# EAGLE design LPC_1TE_3.42b (EAGLE 5.04)
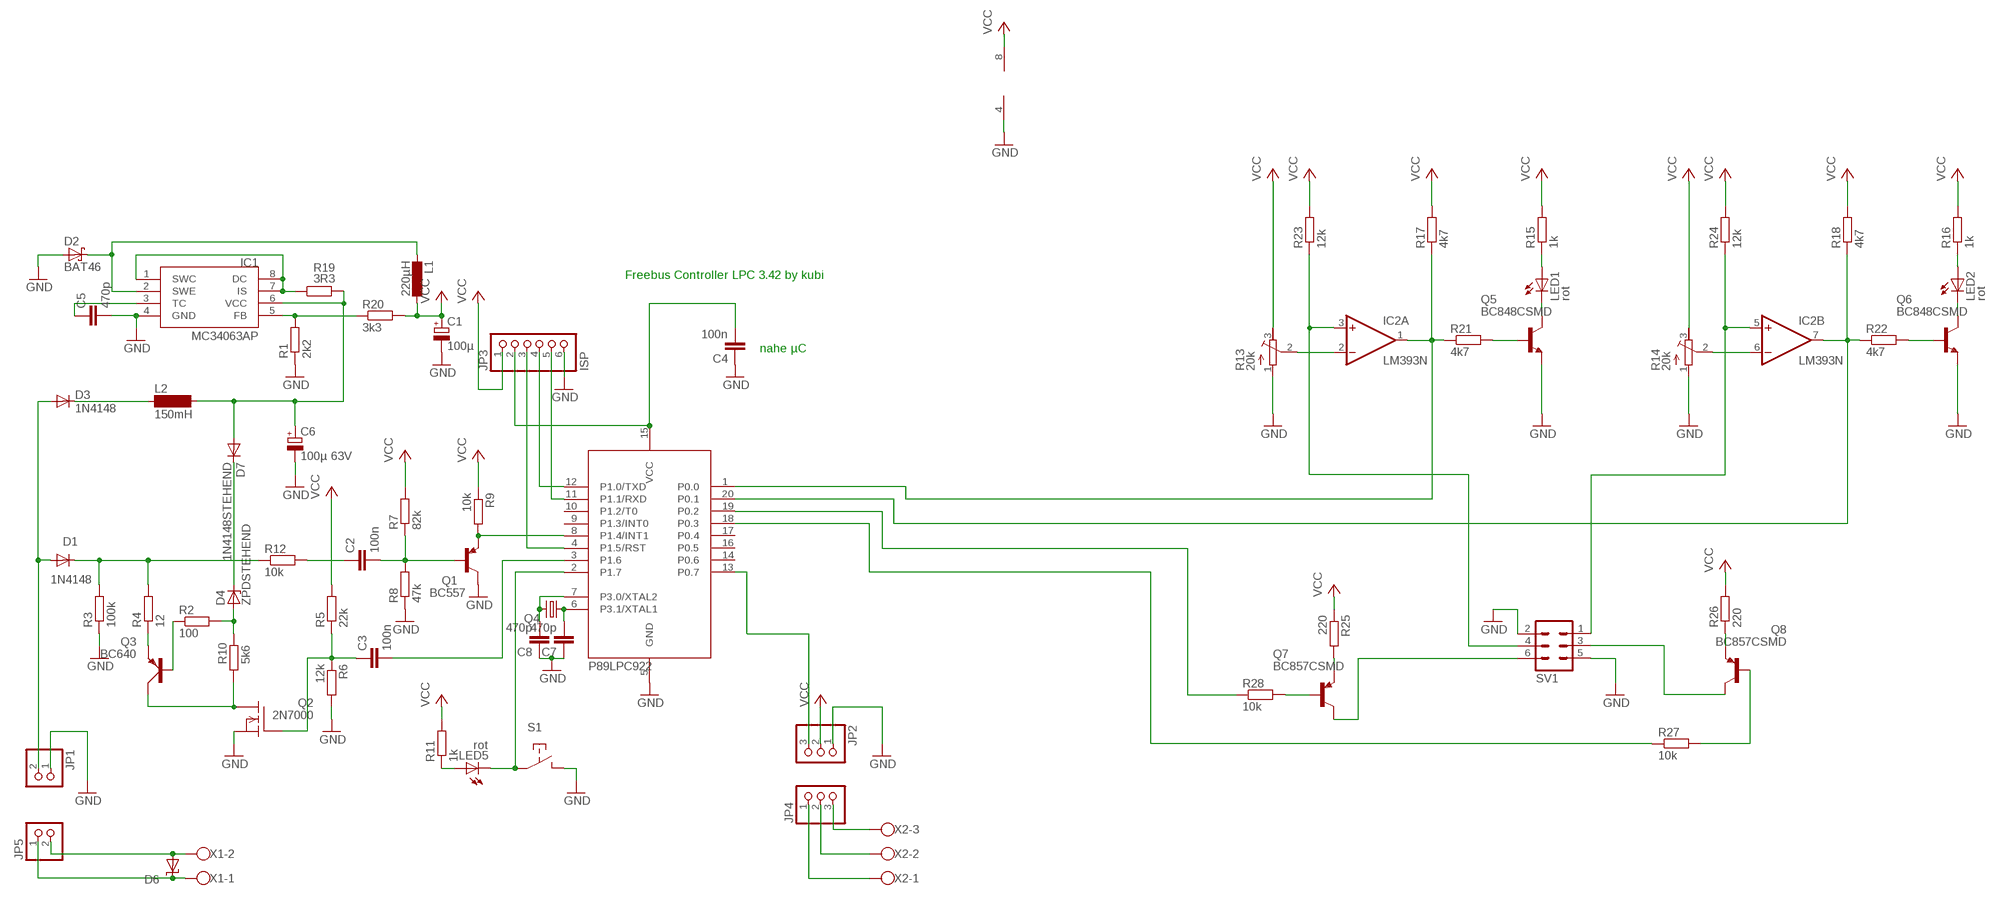
[diagram p0: schematic, sheet 1]

## Parts
C1  100µ  CPOL-EUE2.5-6  [E2,5-6]
C2  100n  C-EU025-024X044  [C025-024X044]
C3  100n  C-EU050-024X044  [C050-024X044]
C4  100n  C-EU050-024X044  [C050-024X044]
C5  470p  C-EU025-024X044  [C025-024X044]
C6  100µ 63V  CPOL-EUE3.5-8  [E3,5-8]
C7  470p  C-EU025-024X044  [C025-024X044]
C8  470p  C-EU025-024X044  [C025-024X044]
D1  1N4148  [DO35-10]
D2  BAT46  BAT49  [DO41-10]
D3  1N4148  [DO35-10]
D4  ZPDSTEHEND  [ZDIODE]
D6  SUPPRESSOR-SMBJ  [SMBJ]
D7  1N4148STEHEND  [D-2.5]
IC1  MC34063AP  [DIL08]
IC2  LM393N  [DIL08]
JP1  PINHD-1X2  [1X02]
JP2  PINHD-1X3  [1X03]
JP3  ISP  PINHD-1X6  [1X06]
JP4  PINHD-1X3  [1X03]
JP5  PINHD-1X2  [1X02]
L1  220µH  L-EU2200-12.7  [2200-12.7]
L2  150mH  SD12K100  [SD12K100]
LED1  rot  LED3MM  [LED3MM]
LED2  rot  LED3MM  [LED3MM]
LED5  rot  LED3MM  [LED3MM]
Q1  BC557  [TO92]
Q2  2N7000  VN2222KM  [TO237]
Q3  BC640  [SOT54D]
Q4  CRYSTALHC49U-V  [HC49U-V]
Q5  BC848CSMD  [SOT23]
Q6  BC848CSMD  [SOT23]
Q7  BC857CSMD  [SOT23-BEC]
Q8  BC857CSMD  [SOT23-BEC]
R1  2k2  R-EU_0207/7  [0207/7]
R2  100  R-EU_0207/2V  [0207/2V]
R3  100k  R-EU_0207/2V  [0207/2V]
R4  12  R-EU_0207/2V  [0207/2V]
R5  22k  R-EU_0207/2V  [0207/2V]
R6  12k  R-EU_0207/2V  [0207/2V]
R7  82k  R-EU_0207/7  [0207/7]
R8  47k  R-EU_0207/7  [0207/7]
R9  10k  R-EU_0207/7  [0207/7]
R10  5k6  R-EU_0207/2V  [0207/2V]
R11  1k  R-EU_0207/7  [0207/7]
R12  10k  R-EU_0207/7  [0207/7]
R13  20k  R-TRIMM64X  [RTRIM64X]
R14  20k  R-TRIMM64X  [RTRIM64X]
R15  1k  R-EU_M1206  [M1206]
R16  1k  R-EU_M1206  [M1206]
R17  4k7  R-EU_M1206  [M1206]
R18  4k7  R-EU_M1206  [M1206]
R19  3R3  R-EU_0207/2V  [0207/2V]
R20  3k3  R-EU_0207/2V  [0207/2V]
R21  4k7  R-EU_M1206  [M1206]
R22  4k7  R-EU_M1206  [M1206]
R23  12k  R-EU_M1206  [M1206]
R24  12k  R-EU_M1206  [M1206]
R25  220  R-EU_M1206  [M1206]
R26  220  R-EU_M1206  [M1206]
R27  10k  R-EU_0207/7  [0207/7]
R28  10k  R-EU_0207/7  [0207/7]
S1  3305  [3305]
SV1  MA03-2LIEGEND  [MA03-2W]
U1  89LPC922  [DIL20]
X1  W237-02P  [W237-132]
X2  W237-03P  [W237-133]

## Nets
GND: C1.- C4.1 C5.2 C6.- C7.1 C8.1 D2.A IC1.4(GND) IC2.4(P:V-) JP1.1 JP2.1 JP3.6 Q1.3(C) Q2.3(S) Q5.2(E) Q6.2(E) R1.1 R3.1 R6.2 R8.1 R13.1(E) R14.1(E) S1.P$2 SV1.2 SV1.5 U1.5(GND)
N$1: Q1.1(E) R9.2 U1.8(P1.4/INT1)
N$2: C2.2 Q1.2(B) R7.1 R8.2
N$3: IC1.5(FB) R1.2 R20.1
N$4: IC1.1(SWC) IC1.7(IS) IC1.8(DC) R19.1
N$5: C3.2 U1.3(P1.6)
N$6: Q2.1(D) Q3.C R10.1
N$7: C6.+ D7.A IC1.6(VCC) L2.2 R19.2
N$8: D3.C L2.1
N$9: D1.C R3.2 R4.2 R12.1
N$10: D2.C IC1.2(SWE) L1.2
N$11: D4.A R2.2 R10.2
N$12: Q3.E R4.1
N$13: C5.1 IC1.3(TC)
N$14: Q3.B R2.1
N$15: LED5.K(C) S1.P$1 U1.2(P1.7)
N$16: D1.A D3.A JP1.2
N$17: D6.A JP5.2 X1.2
N$18: D6.C JP5.1 X1.1
N$19: JP4.3 X2.3
N$20: IC2.6(B:-IN) R14.2(S)
N$21: IC2.2(A:-IN) R13.2(S)
N$22: LED1.K(C) Q5.3(C)
N$23: LED1.A R15.1
N$24: C7.2 Q4.1 U1.6(P3.1/XTAL1)
N$25: C8.2 Q4.2 U1.7(P3.0/XTAL2)
N$26: JP4.2 X2.2
N$27: JP4.1 X2.1
N$28: JP2.3 U1.13(P0.7)
N$29: JP3.4 U1.12(P1.0/TXD)
N$30: JP3.5 U1.11(P1.1/RXD)
N$31: JP3.3 U1.4(P1.5/RST)
N$32: C4.2 JP3.2 U1.15(VCC)
N$33: C2.1 R12.2
N$34: C3.1 Q2.2(G) R5.1 R6.1
N$35: IC2.1(A:OUT) R17.1 R21.1 U1.1(P0.0)
N$36: LED2.K(C) Q6.3(C)
N$37: IC2.7(B:OUT) R18.1 R22.1 U1.20(P0.1)
N$38: Q5.1(B) R21.2
N$39: Q6.1(B) R22.2
N$40: D4.C D7.C
N$41: LED5.A R11.1
N$42: LED2.A R16.1
N$43: IC2.3(A:+IN) R23.1 SV1.4
N$44: IC2.5(B:+IN) R24.1 SV1.1
N$45: Q7.B R28.2
N$46: Q8.E R26.1
N$47: Q7.C SV1.6
N$48: Q7.E R25.2
N$49: Q8.C SV1.3
N$51: R28.1 U1.19(P0.2)
N$52: R27.1 U1.18(P0.3)
N$53: Q8.B R27.2
VCC: C1.+ IC2.8(P:V+) JP2.2 JP3.1 L1.1 R5.2 R7.2 R9.1 R11.2 R13.3(A) R14.3(A) R15.2 R16.2 R17.2 R18.2 R20.2 R23.2 R24.2 R25.1 R26.2
Unconnected: U1.9(P1.3/INT0) U1.10(P1.2/T0) U1.14(P0.6) U1.16(P0.5) U1.17(P0.4)

## Notes on the sheet
- Freebus Controller LPC 3.42 by kubi
- nahe µC
- P89LPC922

## Library data of the parts
C1 C6 = rcl:CPOL-EU: POLARIZED CAPACITOR, European symbol
C2-C5 C7 C8 = rcl:C-EU: CAPACITOR, European symbol
D1 D3 D7 = diode:1N4148: DIODE high speed (Philips)
D2 = diode:BAT49: DIODE small signal diode
D4 = diode:ZPD: Z DIODE 500 mW
D6 = diode:SUPPRESSOR-: Suppressor diode
IC1 = mc34063:MC34063
IC2 = linear:LM393: COMPARATOR
JP1 JP5 = pinhead:PINHD-1X2: PIN HEADER
JP2 JP4 = pinhead:PINHD-1X3: PIN HEADER
JP3 = pinhead:PINHD-1X6: PIN HEADER
L1 = rcl:L-EU: INDUCTOR, European symbol
L2 = inductor-neosid:SD12: INDUCTOR nominal inductance
LED1 LED2 LED5 = led:LED: LED OSRAM: - CHIPLED LG R971, LG N971, LY N971, LG Q971, LY Q971, LO R971, LY R971 LH N974, LH R974 LS Q976, LO Q976, LY Q976 LO Q996 - Hyper CHIPLED LW Q18S LB Q993, LB Q99A, LB R99A - SideLED LS A670, LO A670, LY A670, LG A670, LP A670 LB A673, LV A673, LT A673, LW A673 LH A674 LY A675 LS A676, LA A676, LO A676, LY A676, LW A676 LS A679, LY A679, LG A679 - Hyper Micro SIDELED® LS Y876, LA Y876, LO Y876, LY Y876 LT Y87S - SmartLED LW L88C, LW L88S LB L89C, LB L89S, LG L890 LS L89K, LO L89K, LY L89K LS L896, LA L896, LO L896, LY L896 - TOPLED LS T670, LO T670, LY T670, LG T670, LP T670 LSG T670, LSP T670, LSY T670, LOP T670, LYG T670 LG T671, LOG T671, LSG T671 LB T673, LV T673, LT T673, LW T673 LH T674 LS T676, LA T676, LO T676, LY T676, LB T676, LH T676, LSB T676, LW T676 LB T67C, LV T67C, LT T67C, LS T67K, LO T67K, LY T67K, LW E67C LS E67B, LA E67B, LO E67B, LY E67B, LB E67C, LV E67C, LT E67C LW T67C LS T679, LY T679, LG T679 LS T770, LO T770, LY T770, LG T770, LP T770 LB T773, LV T773, LT T773, LW T773 LH T774 LS E675, LA E675, LY E675, LS T675 LS T776, LA T776, LO T776, LY T776, LB T776 LHGB T686 LT T68C, LB T68C - Hyper Mini TOPLED® LB M676 - Mini TOPLED Santana® LG M470 LS M47K, LO M47K, LY M47K Source: http://www.osram.convergy.de - LUMILED® LXK2-PW12-R00, LXK2-PW12-S00, LXK2-PW14-U00, LXK2-PW14-V00 LXK2-PM12-R00, LXK2-PM12-S00, LXK2-PM14-U00 LXK2-PE12-Q00, LXK2-PE12-R00, LXK2-PE12-S00, LXK2-PE14-T00, LXK2-PE14-U00 LXK2-PB12-K00, LXK2-PB12-L00, LXK2-PB12-M00, LXK2-PB14-N00, LXK2-PB14-P00, LXK2-PB14-Q00 LXK2-PR12-L00, LXK2-PR12-M00, LXK2-PR14-Q00, LXK2-PR14-R00 LXK2-PD12-Q00, LXK2-PD12-R00, LXK2-PD12-S00 LXK2-PH12-R00, LXK2-PH12-S00 LXK2-PL12-P00, LXK2-PL12-Q00, LXK2-PL12-R00 Source: www.luxeon.com
Q1 = transistor-pnp:BC557: PNP Transistor
Q2 = transistor-fet:VN2222KM: N-Channel Enhancement MOSFET (VMOS); 60V; 0,5A; 7,5Ohm
Q3 = transistor-small-signal:BC640: PNP TRANSISTOR
Q4 = crystal:CRYSTAL: CRYSTAL
Q5 Q6 = transistor-npn:BC848*: NPN Transistor
Q7 Q8 = transistor-pnp:BC857*: PNP Transistror
R1-R12 R15-R28 = rcl:R-EU_: RESISTOR, European symbol
R13 R14 = rcl:R-TRIMM: Trimm resistor
S1 = kubi:3305: Taster 3305
SV1 = con-lstb:MA03-2: PIN HEADER
U1 = micro-philips:89LPC922
X1 = con-wago-508:W237-02P: WAGO SREW CLAMP
X2 = con-wago-508:W237-03P: WAGO SREW CLAMP

## Board
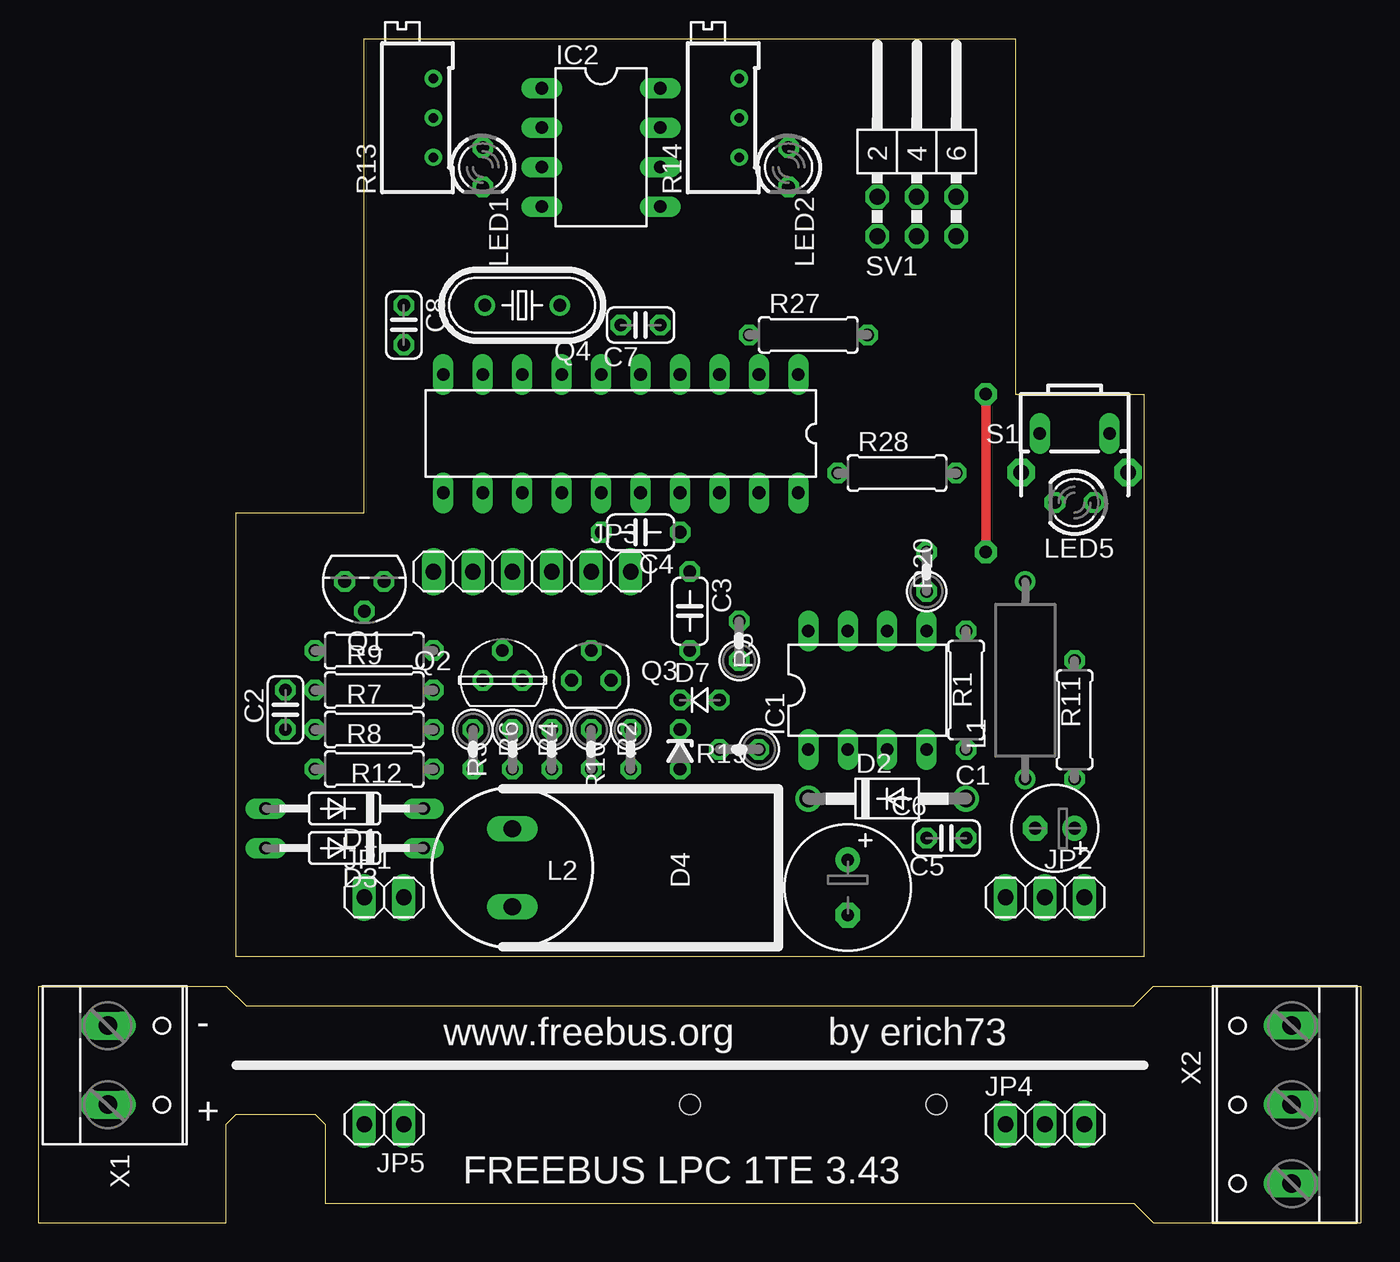
[diagram p1: board, top side]
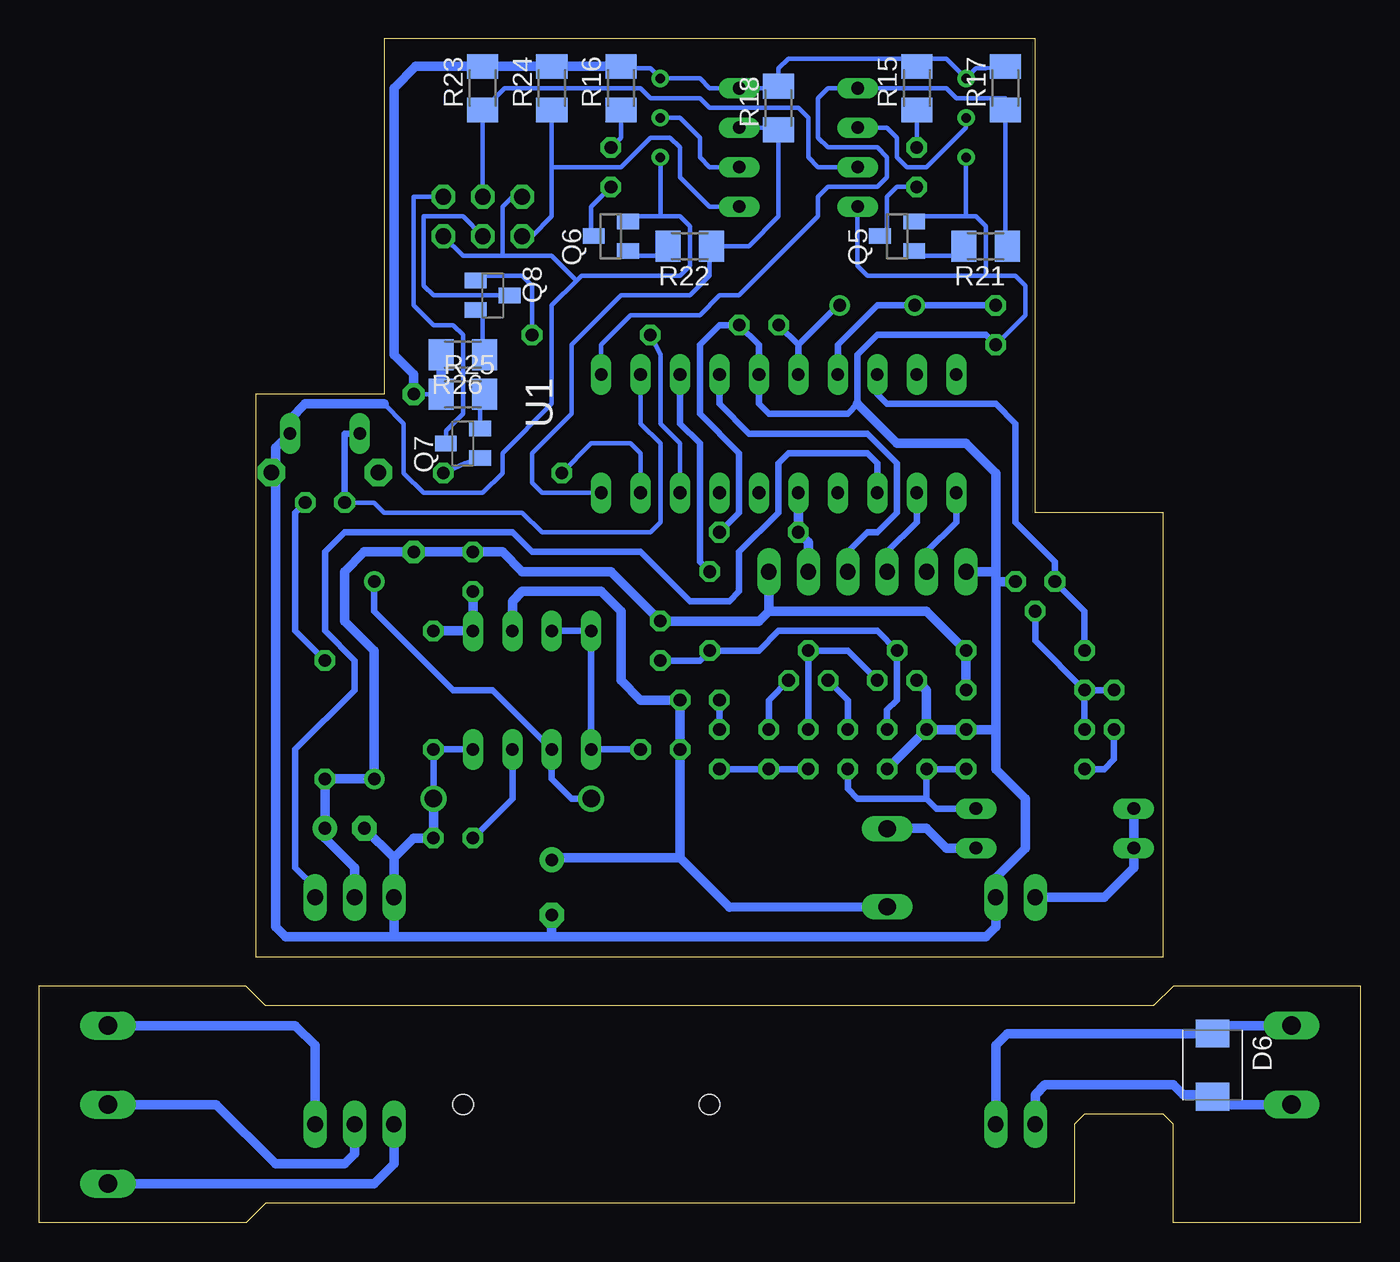
[diagram p2: board, bottom side, seen from below]

Size 85.09 x 76.2 mm. Coordinates in mm from the lower left corner, seen from the top.
Outline: 12.7,17.14 12.7,45.72 20.95,45.72 20.95,76.2 62.87,76.2 62.87,53.34 71.12,53.34 71.12,17.14 12.7,17.14
Outline: 0,0 12.06,0 12.06,6.35 12.7,6.98 17.78,6.98 18.41,6.35 18.41,1.27 70.48,1.27 71.75,0 85.09,0 85.09,15.24 71.75,15.24 70.48,13.97 13.34,13.97 12.06,15.24 0,15.24 0,0
Copper layers (1*16): Top 0.035mm / dielectric 1.5mm / Bottom 0.035mm
Design rules "default *": minimum track width 10mil, minimum drill 24mil, track to track 12mil, track to pad 10mil, pad to pad 12mil, via to via 12mil, smd to smd 8mil, copper to edge 10mil, drill to drill 8mil, minimum pad ring 10mil, minimum via ring 8mil, stop-mask expansion 4mil, vias tented up to drill 0mil, thermal gap 10mil
Holes 1.3 mm at 57.79,7.62 41.91,7.62

### Footprints (pad centres in the part's own frame; a part is rotated, then mirrored left to right if it is on the bottom)
E2,5-6 = drill 0.813 pad 1.6 round: + -1.27,0 | drill 0.813 pad 1.6 octagon: - 1.27,0
C025-024X044 = drill 0.813 octagon: 1 -1.27,0; 2 1.27,0
C050-024X044 = drill 0.813 octagon: 1 -2.54,0; 2 2.54,0
E3,5-8 = drill 0.813 pad 1.6 round: + -1.778,0 | drill 0.813 pad 1.6 octagon: - 1.778,0
DO35-10 = drill 0.813 long: A 5.08,0; C -5.08,0
DO41-10 = drill 1.118 round: A 5.08,0; C -5.08,0
ZDIODE = drill 0.813 octagon: A 1.27,0; C -1.27,0
SMBJ = smd 1.78 x 2.16: A 2.04,0; C -2.03,0
D-2.5 = drill 0.813 octagon: A 1.27,0; C -1.27,0
DIL08 = drill 0.813 long: 1 -3.81,-3.81; 2 -1.27,-3.81; 3 1.27,-3.81; 4 3.81,-3.81; 5 3.81,3.81; 6 1.27,3.81; 7 -1.27,3.81; 8 -3.81,3.81
1X02 = drill 1.016 long: 1 -1.27,0; 2 1.27,0
1X03 = drill 1.016 long: 1 -2.54,0; 2 0,0; 3 2.54,0
1X06 = drill 1.016 long: 1 -6.35,0; 2 -3.81,0; 3 -1.27,0; 4 1.27,0; 5 3.81,0; 6 6.35,0
2200-12.7 = drill 0.8 pad 1.27 round: 1 -6.35,0; 2 6.35,0
SD12K100 = drill 1.1 long: 1 -2.5,0; 2 2.5,0
LED3MM = drill 0.813 octagon: A -1.27,0; K 1.27,0
TO92 = drill 0.813 octagon: 1 1.27,0; 2 0,1.905; 3 -1.27,0
TO237 = drill 0.813 octagon: 1 1.27,0; 2 0,1.905; 3 -1.27,0
SOT54D = drill 0.813 octagon: B 1.27,0; C 0,1.905; E -1.27,0
HC49U-V = drill 0.813 round: 1 -2.413,0; 2 2.413,0
SOT23 = smd 1 x 1.4: 1 -0.95,-1.1; 2 0.95,-1.1; 3 0,1.1
SOT23-BEC = smd 1 x 1.4: B -0.95,-1.1; C 0,1.1; E 0.95,-1.1
0207/7 = drill 0.813 octagon: 1 -3.81,0; 2 3.81,0
0207/2V = drill 0.813 octagon: 1 -1.27,0; 2 1.27,0
RTRIM64X = drill 0.61 round: 1 1.27,-2.54; 2 1.27,0; 3 1.27,2.54
M1206 = smd 1.6 x 2: 1 -1.4,0; 2 1.4,0
3305 = drill 0.8 long: P$1 -2.25,0; P$2 2.25,0 | drill 1 pad 1.778 octagon: P$3 -3.45,-2.5; P$4 3.45,-2.5
MA03-2W = drill 1.016 octagon: 1 -2.54,-5.08; 2 -2.54,-2.54; 3 0,-5.08; 4 0,-2.54; 5 2.54,-5.08; 6 2.54,-2.54
DIL20 = drill 0.813 long: 1 -11.43,-3.81; 2 -8.89,-3.81; 3 -6.35,-3.81; 4 -3.81,-3.81; 5 -1.27,-3.81; 6 1.27,-3.81; 7 3.81,-3.81; 8 6.35,-3.81; 9 8.89,-3.81; 10 11.43,-3.81; 11 11.43,3.81; 12 8.89,3.81; 13 6.35,3.81; 14 3.81,3.81; 15 1.27,3.81; 16 -1.27,3.81; 17 -3.81,3.81; 18 -6.35,3.81; 19 -8.89,3.81; 20 -11.43,3.81
W237-132 = drill 1.194 long: 1 -2.54,-0.635; 2 2.54,-0.635
W237-133 = drill 1.194 long: 1 -5.08,-0.635; 2 0,-0.635; 3 5.08,-0.635

### Placement (x,y rotation side)
C1  65.41,25.4 180 top
C2  15.88,33.02 90 top
C3  41.91,39.37 90 top
C4  38.73,44.45 180 top
C5  58.42,24.77 0 top
C6  52.07,21.59 270 top
C7  38.73,57.79 180 top
C8  23.49,57.79 90 top
D1  19.68,26.67 180 top
D2  54.61,27.3 0 top
D3  19.68,24.13 180 top
D4  41.27,30.48 270 top
D6  9.53,10.16 270 bottom
D7  42.55,33.66 0 top
IC1  53.34,34.29 0 top
IC2  36.2,69.21 270 top
JP1  22.22,20.95 180 top
JP2  64.77,20.95 0 top
JP3  31.75,41.91 180 top
JP4  64.77,6.35 0 top
JP5  22.22,6.35 180 top
L1  63.5,34.93 90 top
L2  30.48,22.86 270 top
LED1  28.57,67.94 270 top
LED2  48.26,67.94 270 top
LED5  66.67,46.36 180 top
Q1  20.95,41.28 180 top
Q2  29.84,34.93 0 top
Q3  35.56,34.93 0 top
Q4  31.11,59.05 180 top
Q5  29.84,63.5 90 bottom
Q6  48.26,63.5 90 bottom
Q7  57.79,50.17 90 bottom
Q8  55.88,59.69 270 bottom
R1  59.69,34.29 90 top
R2  38.1,30.48 270 top
R3  27.94,30.48 270 top
R4  33.02,30.48 270 top
R5  45.09,37.47 90 top
R6  30.48,30.48 270 top
R7  21.59,34.29 0 top
R8  21.59,31.75 180 top
R9  21.59,36.83 180 top
R10  35.56,30.48 270 top
R11  66.67,32.38 270 top
R12  21.59,29.21 180 top
R13  24.13,71.12 0 top
R14  43.82,71.12 0 top
R15  28.57,73.02 90 bottom
R16  47.62,73.02 90 bottom
R17  22.86,73.02 90 bottom
R18  37.47,71.75 90 bottom
R19  45.09,30.48 180 top
R20  57.15,41.91 90 top
R21  24.13,62.87 180 bottom
R22  43.18,62.87 180 bottom
R23  56.52,73.02 90 bottom
R24  52.07,73.02 90 bottom
R25  57.79,53.34 0 bottom
R26  57.79,55.88 180 bottom
R27  49.53,57.15 0 top
R28  55.25,48.26 0 top
S1  66.67,50.8 0 top
SV1  56.52,68.58 0 top
U1  37.47,50.8 180 top
X1  5.08,10.16 270 top
X2  80.01,7.62 90 top

### Tracks (layer width: path | path; a pad name or v marks a point on that pad's centre or on a via)
GND
  Bottom 0.305: IC2.4 32.39,61.6 31.75,60.96 24.13,60.96 | 24.13,60.96 24.13,64.14 24.76,64.77 25.4,64.77 | 25.4,64.77 R13.1 | 25.4,64.77 28.57,64.77 Q5.2 | C8.1 21.59,58.42 21.59,60.33 22.22,60.96 24.13,60.96 | Q6.2 46.99,64.77 45.09,64.77 | 45.09,64.77 R14.1 | 45.09,64.77 43.82,64.77 43.18,64.14 43.18,61.6 43.82,60.96 50.16,60.96 50.48,60.64 | 50.48,60.64 52.07,59.05 52.07,52.71 55.25,49.53 55.25,48.26 56.52,46.99 60.33,46.99 61.59,48.26 61.59,51.44 62.87,52.71 | SV1.5 57.79,62.23 55.25,62.23 | 55.25,62.23 52.07,62.23 50.48,60.64 | SV1.2 54.61,66.04 55.25,65.41 55.25,62.23
  Bottom 0.406: IC1.4 R1.1 D2.A | C8.1 24.13,57.15 31.11,57.15 32.39,55.88 32.39,52.71 33.02,52.07 38.1,52.07 38.73,52.71 U1.5 38.73,56.52 C7.1 41.27,57.79 42.55,56.52 42.55,52.07 40.01,49.53 40.01,45.72 C4.1
  Bottom 0.61: R3.1 R6.2 | 62.23,18.41 69.21,18.41 69.85,19.05 69.85,49.88 S1.P$2 68.92,51.73 67.94,52.71 62.87,52.71 | 62.23,18.41 JP2.1 62.23,23.5 | R3.1 27.94,34.29 Q2.3 | 23.49,31.75 23.49,41.28 | 23.49,41.28 Q1.3 | 23.49,31.75 R8.1 R3.1 | 23.49,31.75 23.49,29.21 21.59,27.3 21.59,24.13 23.49,22.22 JP1.1 23.49,19.05 24.13,18.41 52.07,18.41 | 52.07,18.41 62.23,18.41 | 52.07,18.41 C6.- | D2.A C5.2 60.96,24.77 62.23,23.5 | 62.23,23.5 C1.- | 23.49,41.91 JP3.6 | 23.49,41.91 23.49,48.26 25.4,50.17 29.84,50.17 32.39,52.71 | 23.49,41.28 23.49,41.91
N$1
  Bottom 0.406: U1.8 31.11,53.34 30.48,52.71 23.49,52.71 22.22,51.44 22.22,45.09 19.68,42.55 Q1.1 17.78,39.37 R9.2
N$2
  Bottom 0.406: R7.1 R8.2 | C2.2 R7.1 | R7.1 20.95,37.47 Q1.2
N$3
  Bottom 0.61: R1.2 IC1.5 R20.1
N$4
  Bottom 0.406: IC1.7 IC1.8 IC1.1 R19.1
N$5
  Bottom 0.406: U1.3 43.82,51.44 42.55,50.17 42.55,42.55 C3.2
N$6
  Bottom 0.406: R10.1 Q3.C 33.02,36.83 Q2.1
N$7
  Bottom 0.61: IC1.6 54.61,40.01 53.98,40.64 48.9,40.64 47.62,39.37 47.62,34.93 46.36,33.66 D7.A R19.2 43.82,23.5 | L2.2 40.64,20.32 43.82,23.5 | C6.+ 52.07,23.5 43.82,23.5
N$8
  Bottom 0.61: L2.1 30.48,25.4 27.94,25.4 26.67,24.13 D3.C
N$9
  Bottom 0.406: 27.94,27.3 R3.2 R12.1 | 27.94,27.3 32.39,27.3 33.02,27.94 R4.2 | D1.C 27.3,26.67 27.94,27.3
N$10
  Bottom 0.406: D2.C 50.8,27.3 52.07,28.57 IC1.2 55.88,34.29 58.42,34.29 63.5,39.37 L1.2
N$11
  Bottom 0.406: D4.A R2.2 R10.2
N$12
  Bottom 0.406: R4.1 33.02,33.66 Q3.E
N$13
  Bottom 0.406: C5.1 54.61,27.3 IC1.3
N$14
  Bottom 0.406: R2.1 38.1,33.66 Q3.B
N$15
  Bottom 0.305: U1.2 46.36,51.44 45.09,50.17 45.09,45.09 45.72,44.45 52.71,44.45 53.98,45.72 62.87,45.72 63.5,46.36 LED5.K
  Bottom 0.406: S1.P$1 65.41,50.8 LED5.K
N$16
  Bottom 0.61: JP1.2 16.51,20.95 14.61,22.86 D3.A D1.A
N$17
  Bottom 0.61: X1.2 9.03,7.62 D6.A 9.66,8.26 11.43,8.26 12.06,8.89 20.32,8.89 20.95,8.26 JP5.2
N$18
  Bottom 0.61: X1.1 9.02,12.7 D6.C 22.73,12.19 23.49,11.43 JP5.1
N$19
  Bottom 0.61: JP4.3 67.31,11.43 68.58,12.7 X2.3
N$20
  Bottom 0.305: R14.2 43.82,71.12 42.55,69.85 42.55,68.58 41.91,67.94 IC2.6
N$21
  Bottom 0.305: R13.2 25.4,70.48 27.94,67.94 29.21,67.94 29.84,68.58 29.84,69.85 30.48,70.48 IC2.2
N$22
  Bottom 0.305: Q5.3 30.48,63.5 30.48,66.04 29.84,66.67 LED1.K
N$23
  Bottom 0.305: LED1.A R15.1
N$24
  Bottom 0.406: 36.2,56.52 U1.6 | Q4.1 33.66,59.05 36.2,56.52 | 36.2,56.52 C7.2
N$25
  Bottom 0.406: U1.7 33.66,56.52 31.11,59.05 Q4.2 C8.2
N$26
  Bottom 0.61: JP4.2 64.77,4.45 65.41,3.81 69.85,3.81 73.66,7.62 X2.2
N$27
  Bottom 0.61: JP4.1 62.23,3.81 63.5,2.54 X2.1
N$28
  Bottom 0.406: U1.13 31.11,48.9 31.75,49.53 36.83,49.53 37.47,48.9 37.47,45.72 40.01,43.18 40.01,40.64 40.64,40.01 43.18,40.01 46.36,43.18 53.34,43.18 54.61,44.45 65.41,44.45 66.67,43.18 66.67,38.1 64.77,36.2 64.77,34.29 68.58,30.48 68.58,22.86 67.31,21.59 JP2.3
N$29
  Bottom 0.406: U1.12 28.57,45.09 30.48,43.18 JP3.4
N$30
  Bottom 0.406: U1.11 26.04,45.09 27.94,43.18 JP3.5
N$31
  Bottom 0.406: U1.4 41.27,52.71 39.37,50.8 31.75,50.8 29.84,48.9 29.84,45.72 31.11,44.45 31.75,44.45 33.02,43.18 JP3.3
N$32
  Bottom 0.61: JP3.2 35.56,43.82 C4.2 U1.15
N$33
  Bottom 0.406: C2.1 15.88,29.84 16.51,29.21 R12.2
N$34
  Bottom 0.406: R6.1 30.48,33.02 29.84,33.66 Q2.2 31.11,38.1 37.47,38.1 38.73,36.83 C3.1 42.55,36.2 R5.1
N$35
  Bottom 0.305: U1.1 48.9,56.52 46.99,58.42 42.55,58.42 41.27,59.69 40.01,59.69 34.93,64.77 34.93,66.04 34.29,66.67 31.11,66.67 30.48,67.31 30.48,68.58 31.11,69.21 34.29,69.21 34.93,69.85 34.93,72.39 34.29,73.02 IC2.1 26.67,73.02 26.04,72.39 22.86,72.39 R17.1 22.86,62.87 R21.1
N$36
  Bottom 0.305: LED2.K 49.53,65.41 49.53,63.5 Q6.3
N$37
  Bottom 0.305: 37.47,70.48 IC2.7 | 37.47,70.48 R18.1 | 37.47,70.48 37.47,64.77 39.37,62.87 R22.1 41.91,62.87 41.91,60.96 43.18,59.69 47.62,59.69 50.8,56.52 50.8,52.07 53.34,49.53 53.34,47.62 52.71,46.99 U1.20
N$38
  Bottom 0.305: Q5.1 28.57,62.23 25.4,62.23 25.4,62.74 R21.2 | R21.2 25.4,63.5 | R21.2 25.4,62.87
N$39
  Bottom 0.305: Q6.1 46.99,62.23 44.45,62.23 44.45,62.87 R22.2
N$40
  Bottom 0.406: D7.C D4.C
N$41
  Bottom 0.406: R11.1 68.58,38.1 68.58,45.72 LED5.A
N$42
  Bottom 0.305: LED2.A 47.62,69.85 R16.1 47.62,71.75
N$43
  Bottom 0.305: IC2.3 34.93,67.94 35.56,68.58 35.56,71.12 36.2,71.75 41.91,71.75 42.55,72.39 45.72,72.39 46.36,73.02 55.12,73.02 R23.1 SV1.4
N$44
  Bottom 0.305: IC2.5 41.91,65.41 43.82,67.31 43.82,69.21 44.45,69.85 45.72,69.85 47.62,67.94 52.07,67.94 | SV1.1 53.34,63.5 52.07,64.77 52.07,67.94 | 52.07,67.94 R24.1
N$45
  Bottom 0.305: R28.2 57.64,48.9 Q7.B
N$46
  Bottom 0.305: Q8.E 56.84,58.74 56.52,58.42 56.52,56.65 R26.1
N$47
  Bottom 0.305: Q7.C 58.89,50.97 57.79,52.07 57.79,57.15 58.42,57.79 59.69,57.79 60.96,59.05 60.96,66.04 SV1.6
N$48
  Bottom 0.305: Q7.E 56.69,53.68 R25.2
N$49
  Bottom 0.305: Q8.C 59.69,59.69 60.33,60.33 60.33,64.77 57.79,64.77 SV1.3
N$51
  Bottom 0.305: U1.19 46.36,49.53 46.99,50.17 49.53,50.17 R28.1
N$52
  Bottom 0.305: U1.18 43.82,50.17 45.09,51.44 45.09,55.88 R27.1
N$53
  Bottom 0.305: R27.2 53.34,60.33 53.98,60.96 57.3,60.96 Q8.B
VCC  (via drill 0.8 pad 1.42)
  Top 0.61: v60.96,43.18 v60.96,53.34
  Bottom 0.305: R17.2 24.13,74.3 24.76,74.3 R13.3 26.67,74.93 28.57,74.93 | 28.57,74.93 R15.2 | 28.57,74.93 36.83,74.93 37.47,74.3 R18.2 37.47,73.02 IC2.8 41.91,73.02 42.55,73.66 R14.3 45.72,74.3 47.62,74.3 R16.2 | v60.96,53.34 R25.1
  Bottom 0.61: R7.2 R9.1 27.94,39.37 38.1,39.37 | JP2.2 64.77,22.86 66.67,24.77 C1.+ R11.2 L1.1 63.5,36.83 65.41,38.74 65.41,41.91 64.13,43.18 v60.96,43.18 R20.2 55.25,43.18 53.98,41.91 48.26,41.91 R5.2 38.73,38.74 38.1,39.37 | 38.1,39.37 JP3.1 | v60.96,53.34 60.96,54.61 62.23,55.88 62.23,73.02 60.83,74.42 R23.2 R24.2 R16.2 | R25.1 R26.2

### Text on the board
tPlace: by erich73
tNames: - | www.freebus.org | + | FREEBUS LPC 1TE 3.43